# EAGLE design MultiRotorHub (EAGLE 7.4.0)
CNAME: MR Hub; CREVISION: 1.0; DESIGNER: Ye Wang
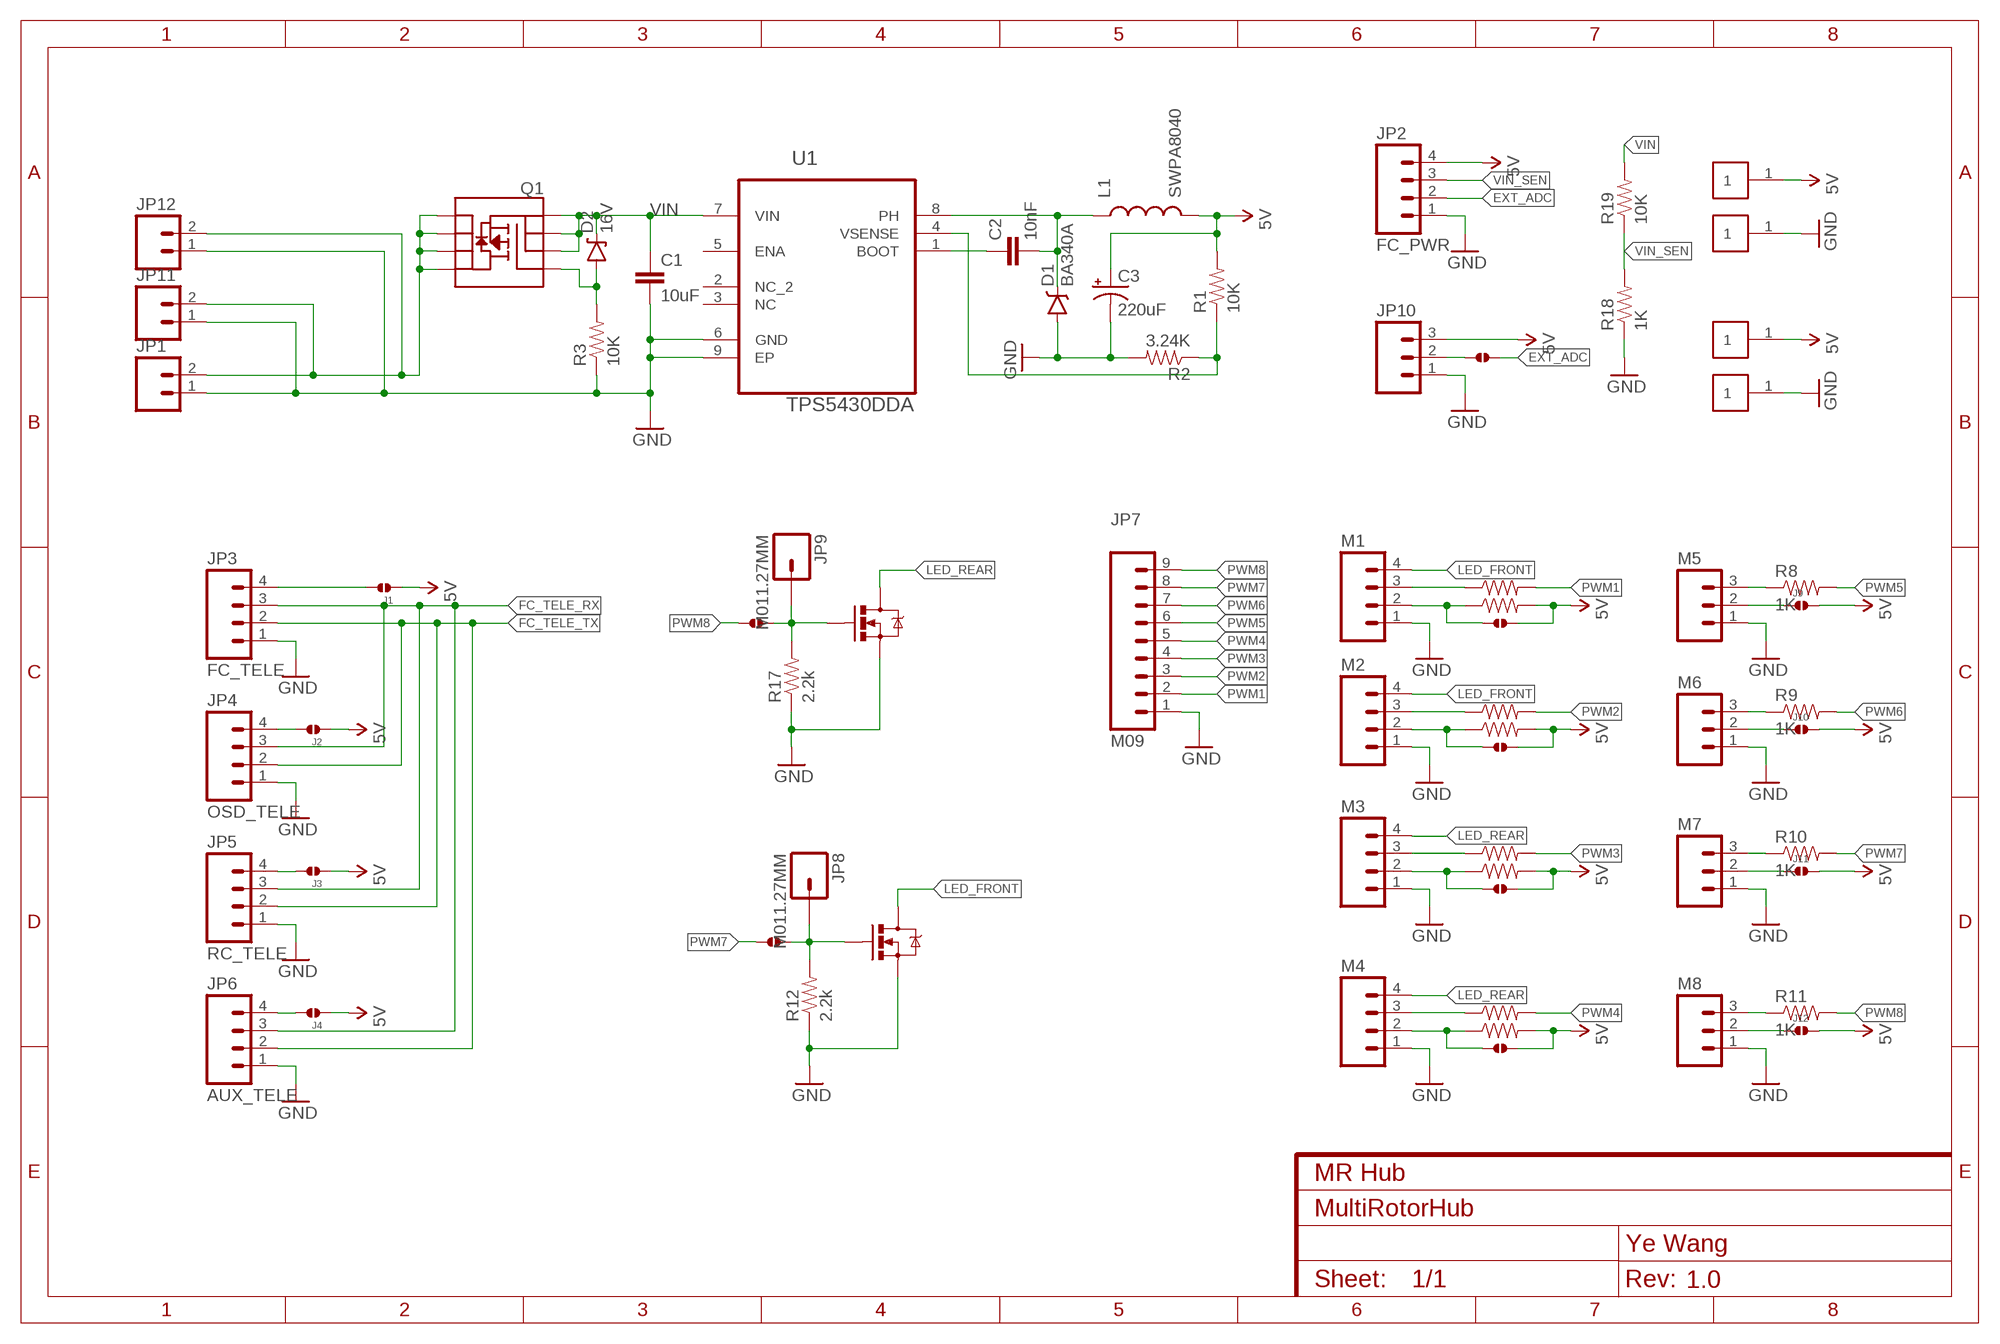
[diagram p0: schematic, sheet 1]

## Parts
C1  10uF  CAP1206  [1206]
C2  10nF  10NF/10000PF-50V-10%(0603)  [0603-CAP]
C3  220uF  CAP_POLD  [PANASONIC_D]
CON1  CON1P2.54MM  [SMD2.54MM]
CON2  CON1P2.54MM  [SMD2.54MM]
CON3  CON1P2.54MM  [SMD2.54MM]
CON4  CON1P2.54MM  [SMD2.54MM]
D1  BA340A  B340A  [SMA-DIODE]
D2  16V  DIODE-ZENER16V  [SOD-123]
J1  SOLDERJUMPER.2.MED  [2.MED]
J2  SOLDERJUMPER.2.MED  [2.MED]
J3  SOLDERJUMPER.2.MED  [2.MED]
J4  SOLDERJUMPER.2.MED  [2.MED]
J5  SOLDERJUMPER.2.MED  [2.MED]
J6  SOLDERJUMPER.2.MED  [2.MED]
J7  SOLDERJUMPER.2.MED  [2.MED]
J8  SOLDERJUMPER.2.MED  [2.MED]
J9  SOLDERJUMPER.2.MED  [2.MED]
J10  SOLDERJUMPER.2.MED  [2.MED]
J11  SOLDERJUMPER.2.MED  [2.MED]
J12  SOLDERJUMPER.2.MED  [2.MED]
J13  SOLDERJUMPER.2.MED  [2.MED]
J14  SOLDERJUMPER.2.MED  [2.MED]
J15  SOLDERJUMPER.2.MED  [2.MED]
JP1  M02PTH  [1X02]
JP2  FC_PWR  M041.27MM  [1X04-1.27MM]
JP3  FC_TELE  M041.27MM  [1X04-1.27MM]
JP4  OSD_TELE  M041.27MM  [1X04-1.27MM]
JP5  RC_TELE  M041.27MM  [1X04-1.27MM]
JP6  AUX_TELE  M041.27MM  [1X04-1.27MM]
JP7  M09  [1X09]
JP8  M011.27MM  [1X01-1.27MM]
JP9  M011.27MM  [1X01-1.27MM]
JP10  M03M03-1.27MM  [1X03-1.27MM]
JP11  M02PTH  [1X02]
JP12  M02PTH  [1X02]
L1  SWPA8040  [INC8040]
M1  M04PTH  [1X04]
M2  M04PTH  [1X04]
M3  M04PTH  [1X04]
M4  M04PTH  [1X04]
M5  M03PTH  [1X03]
M6  M03PTH  [1X03]
M7  M03PTH  [1X03]
M8  M03PTH  [1X03]
Q1  MOSFET-PCHANNEL-SOIC8SOIC8  [SO08]
Q2  MOSFET-NCHANNELBSS123LT1G  [SOT23-3]
Q3  MOSFET-NCHANNELBSS123LT1G  [SOT23-3]
R1  10K  10KOHM-1/10W-1%(0603)0603  [0603-RES]
R2  3.24K  RESISTOR0603-RES  [0603-RES]
R3  10K  10KOHM-1/10W-1%(0603)0603  [0603-RES]
R4  1K  RESISTOR0603-RES  [0603-RES]
R5  1K  RESISTOR0603-RES  [0603-RES]
R6  1K  RESISTOR0603-RES  [0603-RES]
R7  1K  RESISTOR0603-RES  [0603-RES]
R8  1K  RESISTOR0603-RES  [0603-RES]
R9  1K  RESISTOR0603-RES  [0603-RES]
R10  1K  RESISTOR0603-RES  [0603-RES]
R11  1K  RESISTOR0603-RES  [0603-RES]
R12  2.2k  2.2KOHM-1/10W-1%(0603)  [0603-RES]
R13  10  RESISTOR2512  [R2512]
R14  10  RESISTOR2512  [R2512]
R15  10  RESISTOR2512  [R2512]
R16  10  RESISTOR2512  [R2512]
R17  2.2k  2.2KOHM-1/10W-1%(0603)  [0603-RES]
R18  1K  1KOHM-1/10W-1%(0603)  [0603-RES]
R19  10K  10KOHM-1/10W-1%(0603)0603  [0603-RES]
U1  TPS5430DDA  [SOIC127P600X170-9N]

## Nets
5V: C3.+ CON1.1 CON3.1 J1.1 J2.1 J3.1 J4.1 J5.2 J6.2 J7.2 J8.2 J9.2 J10.2 J11.2 J12.2 JP2.4 JP10.3 L1.2 R1.2 R13.2 R14.2 R15.2 R16.2
EXT_ADC: J15.2 JP2.2
FC_TELE_RX: JP3.3 JP4.3 JP5.3 JP6.3
FC_TELE_TX: JP3.2 JP4.2 JP5.2 JP6.2
GND: C1.2 C3.- CON2.1 CON4.1 D1.A JP1.1 JP2.1 JP3.1 JP4.1 JP5.1 JP6.1 JP7.1 JP10.1 JP11.1 JP12.1 M1.1 M2.1 M3.1 M4.1 M5.1 M6.1 M7.1 M8.1 Q2.2(S) Q3.2(S) R2.2 R3.1 R12.1 R17.1 R18.1 U1.6(GND) U1.9(EP)
LED_FRONT: M1.4 M2.4 Q2.3(D)
LED_REAR: M3.4 M4.4 Q3.3(D)
N$1: C2.1 U1.1(BOOT)
N$2: J1.2 JP3.4
N$4: R1.1 R2.1 U1.4(VSENSE)
N$5: D2.A Q1.4(G) R3.2
N$6: J3.2 JP5.4
N$8: J4.2 JP6.4
N$9: J2.2 JP4.4
N$10: J5.1 M1.2 R13.1
N$11: M1.3 R4.1
N$12: J6.1 M2.2 R14.1
N$13: M2.3 R5.1
N$14: J7.1 M3.2 R15.1
N$15: M3.3 R6.1
N$16: J8.1 M4.2 R16.1
N$17: M4.3 R7.1
N$18: J9.1 M5.2
N$19: M5.3 R8.1
N$20: J10.1 M6.2
N$21: M6.3 R9.1
N$22: J11.1 M7.2
N$23: M7.3 R10.1
N$24: J12.1 M8.2
N$25: M8.3 R11.1
N$26: J13.2 JP8.1 Q2.1(G) R12.2
N$27: J14.2 JP9.1 Q3.1(G) R17.2
N$28: J15.1 JP10.2
PWM1: JP7.2 R4.2
PWM2: JP7.3 R5.2
PWM3: JP7.4 R6.2
PWM4: JP7.5 R7.2
PWM5: JP7.6 R8.2
PWM6: JP7.7 R9.2
PWM7: J13.1 JP7.8 R10.2
PWM8: J14.1 JP7.9 R11.2
V_BATT: JP1.2 JP11.2 JP12.2 Q1.5(D) Q1.6(D) Q1.7(D) Q1.8(D)
V_OUT: C2.2 D1.C L1.1 U1.8(PH)
VIN: C1.1 D2.C Q1.1(S) Q1.2(S) Q1.3(S) R19.2 U1.7(VIN)
VIN_SEN: JP2.3 R18.2 R19.1
Unconnected: U1.2(NC_2) U1.3(NC) U1.5(ENA)

## Library data of the parts
C1 = SparkFun-Capacitors:CAP: Capacitor Standard 0603 ceramic capacitor, and 0.1" leaded capacitor.
C2 = SparkFun-Capacitors:10NF/10000PF-50V-10%(0603): CAP-00867; PROD_ID: CAP-00867
C3 = SparkFun-Capacitors:CAP_POL: Capacitor Polarized These are standard SMD and PTH capacitors. Normally 10uF, 47uF, and 100uF in electrolytic and tantalum varieties. Always verify the external diameter of the through hole cap, it varies with capacity, voltage, and manufacturer. The EIA devices should be standard.
CON1-CON4 = szjlc:CON1P
D1 = SparkFun-DiscreteSemi:B340A: Schottky Diode 3A-40V; PROD_ID: DIO-09886
D2 = SparkFun-DiscreteSemi:DIODE-ZENER: Zener Diode Production Part - 8199 3.4V Zener Voltage; PROD_ID: DIO-12440
J1-J15 = solderjumper:SOLDERJUMPER.2
JP1 JP11 JP12 = SparkFun-Connectors:M02: Standard 2-pin 0.1" header. Use with - straight break away headers ( PRT-00116) - right angle break away headers (PRT-00553) - swiss pins (PRT-00743) - machine pins (PRT-00117) - female headers (PRT-00115) Molex polarized connector foot print use with: PRT-08233 with associated crimp pins and housings. 2.54_SCREWTERM for use with PRT-10571. 3.5mm Screw Terminal footprints for PRT-08084 5mm Screw Terminal footprints for use with PRT-08432
JP2-JP6 M1-M4 = SparkFun-Connectors:M04: Header 4 Standard 4-pin 0.1" header. Use with straight break away headers (SKU : PRT-00116), right angle break away headers (PRT-00553), swiss pins (PRT-00743), machine pins (PRT-00117), and female headers (PRT-00115). Molex polarized connector foot print use with SKU : PRT-08231 with associated crimp pins and housings. 1MM SMD Version SKU: PRT-10208
JP7 = SparkFun-Connectors:M09: Header 9 Standard 9-pin 0.1" header. Use with straight break away headers (SKU : PRT-00116), right angle break away headers (PRT-00553), swiss pins (PRT-00743), machine pins (PRT-00117), and female headers (PRT-00115).
JP8 JP9 = SparkFun-Connectors:M01: Header 1 Standard 1-pin 0.1" header. Use with straight break away headers (SKU : PRT-00116), right angle break away headers (PRT-00553), swiss pins (PRT-00743), machine pins (PRT-00117), and female headers (PRT-00115).
JP10 M5-M8 = SparkFun-Connectors:M03: Header 3 Standard 3-pin 0.1" header. Use with straight break away headers (SKU : PRT-00116), right angle break away headers (PRT-00553), swiss pins (PRT-00743), machine pins (PRT-00117), and female headers (PRT-00115). Molex polarized connector foot print use with SKU : PRT-08232 with associated crimp pins and housings.
L1 = inductor:SWPA
Q1 = SparkFun-DiscreteSemi:MOSFET-PCHANNEL-SOIC8: Generic 8-pin PMOSFET
Q2 Q3 = SparkFun-DiscreteSemi:MOSFET-NCHANNEL: Common NMOSFET Parts MFG P/N Store ID Prod ID FDD8780 TRANS-09984 SI7820DN TRANS-11055 FDS6630A IC-08089 2N7002PW TRANS-11151 FQP30N06L COM-10213 TRANS-10060 BSS123LT1G TRANS-08345 BSS138 TRANS-00830 BS170 2N7000; PROD_ID: TRANS-08345
R1 R3 R19 = SparkFun-Resistors:10KOHM-1/10W-1%(0603): RES-00824; PROD_ID: RES-00824
R2 R4-R11 R13-R16 = SparkFun-Resistors:RESISTOR: Resistor Basic schematic elements and footprints for 0603, 1206, and PTH resistors.
R12 R17 = SparkFun-Resistors:2.2KOHM-1/10W-1%(0603): RES-08272; PROD_ID: RES-08272
R18 = SparkFun-Resistors:1KOHM-1/10W-1%(0603): RES-07856; PROD_ID: RES-07856
U1 = ti_misc:TPS5430DDA: 3-A, WIDE INPUT RANGE, STEP-DOWN SWIFT CONVERTER; MPN: TPS5430DDA; OC_FARNELL: -; OC_NEWARK: 75K1619; PACKAGE: SOIC-8; SUPPLIER: Texas Instruments

## Board
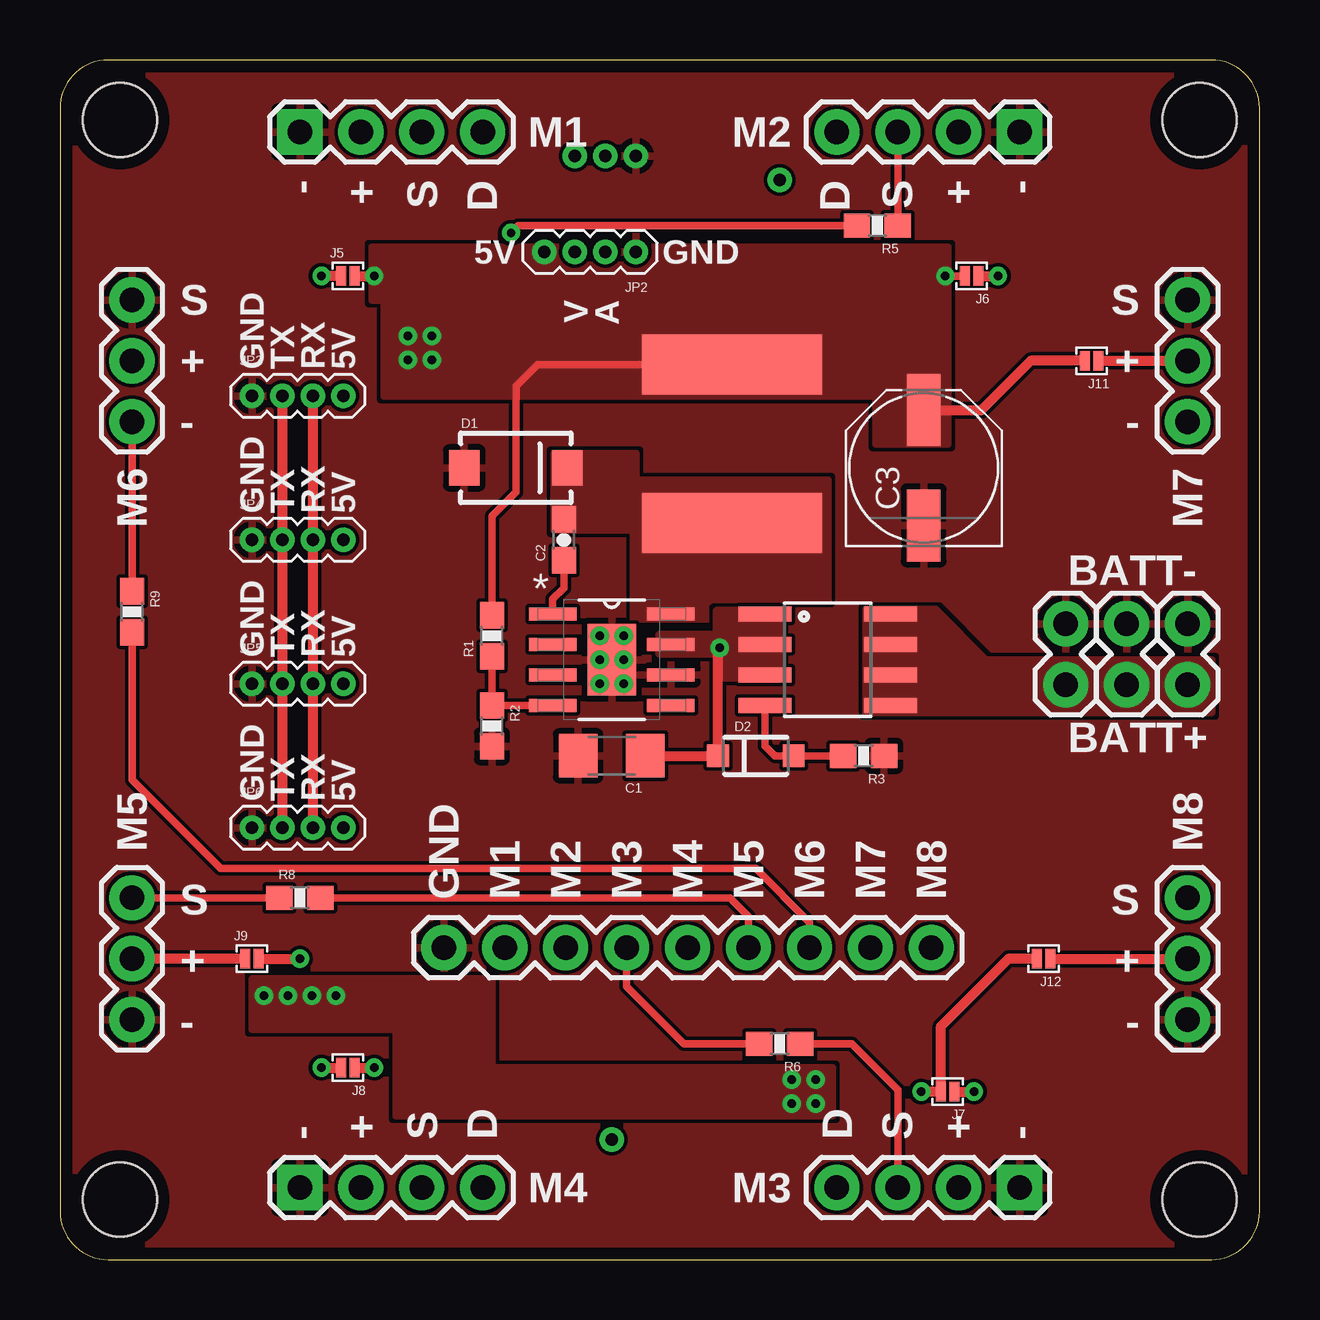
[diagram p1: board, top side]
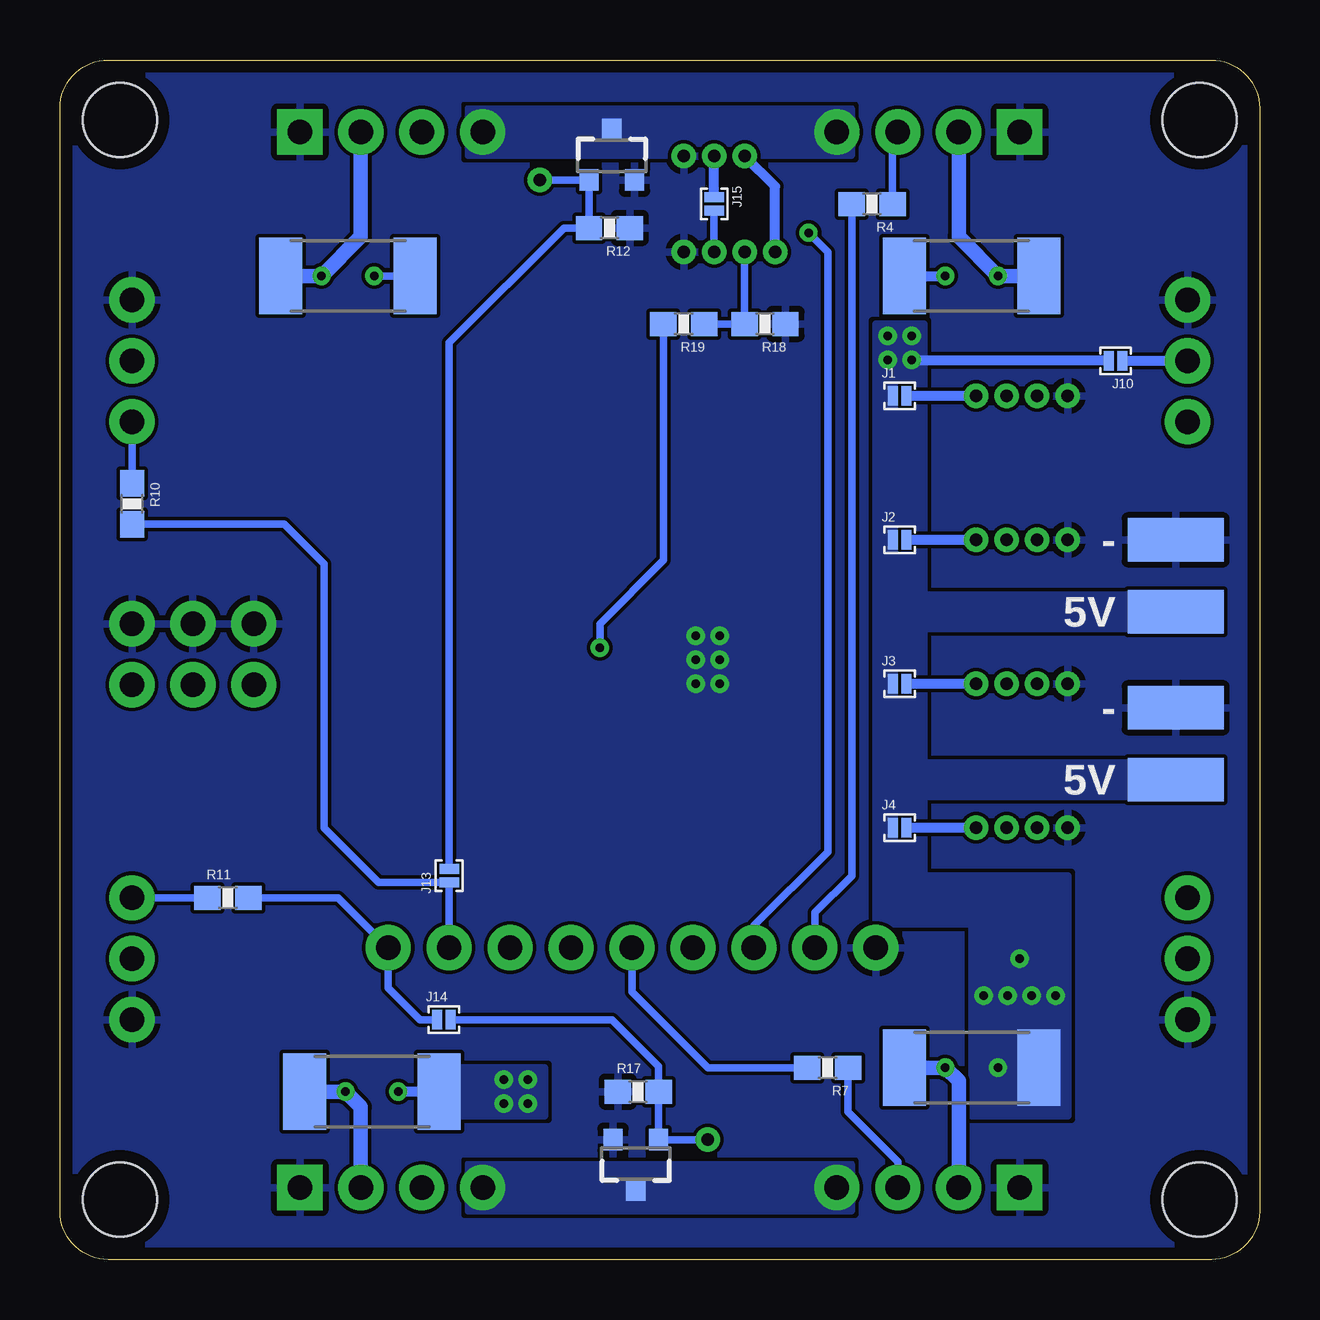
[diagram p2: board, bottom side, seen from below]

Size 50 x 50 mm. Coordinates in mm from the lower left corner, seen from the top.
Outline: 2,0 48,0 arc90 50,2 50,48 arc90 48,50 2,50 arc90 0,48 0,2 arc90 2,0
Copper layers (1*16): Top 0.035mm / dielectric 1.5mm / Bottom 0.035mm
Design rules "default *": minimum track width 8mil, minimum drill 0.3mm, track to track 6mil, track to pad 6mil, pad to pad 6mil, via to via 6mil, smd to smd 6mil, copper to edge 20mil, drill to drill 8mil, minimum pad ring 10mil, minimum via ring 8mil, stop-mask expansion 4mil, vias tented up to drill 0.355mm, thermal gap 10mil
Holes 3.1 mm at 2.5,2.5 47.5,2.5 47.5,47.5 2.5,47.5

### Footprints (pad centres in the part's own frame; a part is rotated, then mirrored left to right if it is on the bottom)
1206 = smd 1.6 x 1.8: 1 -1.4,0; 2 1.4,0
0603-CAP = smd 1.1 x 1: 1 -0.85,0; 2 0.85,0
PANASONIC_D = smd 3 x 1.4: + 2.4,0; - -2.4,0
SMD2.54MM = smd 1.8 x 4: 1 0,0
SMA-DIODE = smd 1.27 x 1.47: A -2.15,0; C 2.15,0
SOD-123 = smd 0.9 x 0.95: A 1.575,0; C -1.575,0
2.MED = smd 0.406 x 0.813: 1 -0.279,0; 2 0.279,0
1X02 = drill 1.016 pad 1.88: 1 0,0; 2 2.54,0
1X04-1.27MM = drill 0.508 pad 1: 1 0,0; 2 1.27,0; 3 2.54,0; 4 3.81,0
1X09 = drill 1.016 pad 1.88: 1 0,0; 2 2.54,0; 3 5.08,0; 4 7.62,0; 5 10.16,0; 6 12.7,0; 7 15.24,0; 8 17.78,0; 9 20.32,0
1X01-1.27MM = drill 0.508 pad 1: 1 0,0
1X03-1.27MM = drill 0.508 pad 1: 1 0,0; 2 1.27,0; 3 2.54,0
INC8040 = smd 2.5 x 7.5: 1 -3.3,0; 2 3.3,0
1X04 = drill 1.016 pad 1.88 square: 1 0,0 | drill 1.016 pad 1.88: 2 2.54,0; 3 5.08,0; 4 7.62,0
1X03 = drill 1.016 pad 1.88: 1 0,0; 2 2.54,0; 3 5.08,0
SO08 = smd 0.61 x 2.21: 1 -1.905,-2.616; 2 -0.635,-2.616; 3 0.635,-2.616; 4 1.905,-2.616; 5 1.905,2.616; 6 0.635,2.616; 7 -0.635,2.616; 8 -1.905,2.616
SOT23-3 = smd 0.8 x 0.9: 1 -0.95,-1; 2 0.95,-1; 3 0,1.1
0603-RES = smd 1.1 x 1: 1 -0.85,0; 2 0.85,0
R2512 = smd 1.8 x 3.2: 1 -2.8,0; 2 2.8,0
SOIC127P600X170-9N = smd 1.981 x 0.559: 1 -2.464,1.905; 2 -2.464,0.635; 3 -2.464,-0.635; 4 -2.464,-1.905; 5 2.464,-1.905; 6 2.464,-0.635; 7 2.464,0.635; 8 2.464,1.905 | smd 2.007 x 2.997: 9 0,0

### Placement (x,y rotation side)
C1  23,21 180 top
C2  21,30 90 top
C3  36,33 90 top
CON1  3.5,27 90 bottom
CON2  3.5,30 270 bottom
CON3  3.5,20 270 bottom
CON4  3.5,23 270 bottom
D1  19,33 0 top
D2  29,21 0 top
J1  15,36 0 bottom
J2  15,30 0 bottom
J3  15,24 0 bottom
J4  15,18 0 bottom
J5  12,41 0 top
J6  38,41 180 top
J7  37,7 180 top
J8  12,8 180 top
J9  8,12.54 0 top
J10  6,37.46 180 bottom
J11  43,37.46 180 top
J12  41,12.54 180 top
J13  33.78,16 90 bottom
J14  34,10 0 bottom
J15  22.73,44 270 bottom
JP1  47,26.5 270 top
JP2  24,42 180 top
JP3  8,36 0 top
JP4  8,30 0 top
JP5  8,24 0 top
JP6  8,18 0 top
JP7  16,13 0 top
JP8  30,45 0 top
JP9  23,5 0 top
JP10  24,46 180 top
JP11  41.92,26.5 270 top
JP12  44.46,26.5 270 top
L1  28,34 90 top
M1  10,47 0 top
M2  40,47 180 top
M3  40,3 180 top
M4  10,3 0 top
M5  3,10 90 top
M6  3,40 270 top
M7  47,40 270 top
M8  47,10 90 top
Q1  32,25 270 top
Q2  27,46 0 bottom
Q3  26,4 180 bottom
R1  18,26 90 top
R2  18,22.25 270 top
R3  33.5,21 180 top
R4  16.15,44 180 bottom
R5  34.07,43.1 180 top
R6  30,9 180 top
R7  18,8 180 bottom
R8  10,15.08 0 top
R9  3,27 270 top
R10  47,31.5 270 bottom
R11  43,15.08 0 bottom
R12  27.1,43 180 bottom
R13  12,41 180 bottom
R14  38,41 0 bottom
R15  37,7 0 bottom
R16  12,8 0 bottom
R17  25.9,7 0 bottom
R18  20.61,39 180 bottom
R19  24,39 180 bottom
U1  23,25 0 top

### Tracks (layer width: path | path; a pad name or v marks a point on that pad's centre or on a via)
5V  (via drill 0.35)
  Top 0.305: R1.2 18,31 19,32 19,36.4 19.9,37.3 L1.2 | v36.9,41 J6.2
  Top 0.406: v10.9,8 J8.2 | v35.9,7 J7.2 36.72,9.72 39.54,12.54 J12.2 | J9.2 v10,12.54 | C3.+ 38.4,35.4 40.46,37.46 J11.2 | J5.2 v13.1,41
  Bottom 0.305: R14.2 v36.9,41
  Bottom 0.406: R15.2 v35.9,7 | R13.2 v13.1,41 | J10.2 14.46,37.46 v14.5,37.5 | JP2.4 20.19,44.73 JP10.3
  other vias: 30.5,6.5 15.5,37.5 15.5,38.5 14.5,38.5 8.5,11 9.5,11 10.5,11 11.5,11 31.5,7.5 31.5,6.5 30.5,7.5
  pour Top (no thermals): 13.5,36 34,36 34,34 37,34 37,42.2 13,42.2 13,40 13.5,40
  pour Bottom (no thermals): 14,39 14,27.7 5,27.7 5,26.3 14,26.3 14,20.7 5,20.7 5,19.3 14,19.3 14,16 8,16 8,6 12,6 12,14 16,14 16,39
  pour Top: 8,9.6 14,9.6 14,6 32.2,6 32.2,8 18,8 18,11.7 8,11.7
  pour Bottom (no thermals): 29.8,6 34,6 34,8 29.8,8
EXT_ADC
  Bottom 0.305: J15.2 JP2.2
FC_TELE_RX
  Top 0.406: JP3.3 JP4.3 JP5.3 JP6.3
FC_TELE_TX
  Top 0.406: JP3.2 JP4.2 JP5.2 JP6.2
GND  (via drill 0.36)
  other vias: 22.5,26 23.5,26 23.5,25 22.5,25 22.5,24 23.5,24
  pour Top (rank 3): 0,50 50,50 50,0 0,0
  pour Bottom (rank 3): 0,0 50,0 50,50 0,50
LED_FRONT
  pour Bottom (no thermals): 17,46 33,46 33,48 17,48
LED_REAR
  pour Bottom (no thermals): 17,2 33,2 33,4 17,4
N$1
  Top 0.305: C2.1 21,28 20.54,27.54 U1.1
N$2
  Bottom 0.406: JP3.4 J1.2
N$4
  Top 0.305: U1.4 R2.1 R1.1
N$5
  Top 0.305: Q1.4 29.38,21.42 29.8,21 D2.A R3.2
N$6
  Bottom 0.406: JP5.4 J3.2
N$8
  Bottom 0.406: JP6.4 J4.2
N$9
  Bottom 0.406: JP4.4 J2.2
N$10  (via drill 0.35)
  Top 0.406: J5.1 v10.9,41
  Bottom 0.61: M1.2 12.54,42.64 v10.9,41 R13.1
N$11
  Bottom 0.305: R4.1 15.3,46.78 M1.3
N$12  (via drill 0.35)
  Top 0.406: J6.1 v39.1,41
  Bottom 0.61: M2.2 37.46,42.64 v39.1,41 R14.1
N$13
  Top 0.305: M2.3 R5.1
N$14  (via drill 0.35)
  Top 0.406: J7.1 v38.1,7
  Bottom 0.61: M3.2 37.46,6.36 v38.1,7 R15.1
N$15
  Top 0.305: M3.3 34.92,7.08 33,9 R6.1
N$16  (via drill 0.35)
  Top 0.406: J8.1 v13.1,8
  Bottom 0.61: M4.2 12.54,7.44 v13.1,8 R16.1
N$17
  Bottom 0.305: M4.3 15.08,4.08 17.15,6.15 R7.1
N$18
  Top 0.406: J9.1 M5.2
N$19
  Top 0.305: M5.3 R8.1
N$20
  Bottom 0.406: J10.1 M6.2
N$21
  Top 0.305: M6.3 R9.1
N$22
  Top 0.406: J11.1 M7.2
N$23
  Bottom 0.305: R10.1 M7.3
N$24
  Top 0.406: J12.1 M8.2
N$25
  Bottom 0.305: M8.3 R11.1
N$26
  Bottom 0.305: JP8.1 Q2.1 R12.2 29,43 33.78,38.22 J13.2
N$27
  Bottom 0.305: J14.2 27,10 25.05,8.05 R17.2 Q3.1 JP9.1
N$28
  Bottom 0.406: J15.1 JP10.2
PWM1
  Bottom 0.305: JP7.2 18.54,14.46 17,16 R4.2
PWM2  (via drill 0.35)
  Top 0.305: R5.2 19.1,43.1 v18.8,42.8
  Bottom 0.305: v18.8,42.8 18,42 18,17 21.08,13.92 JP7.3
PWM3
  Top 0.305: JP7.4 23.62,11.38 26,9 R6.2
PWM4
  Bottom 0.305: JP7.5 26.16,11.16 23,8 R7.2
PWM5
  Top 0.305: JP7.6 28.7,14.3 27.92,15.08 R8.2
PWM6
  Top 0.305: JP7.7 31.24,14.06 29,16.3 6.7,16.3 3,20 R9.2
PWM7
  Bottom 0.305: R10.2 40.65,30.65 39,29 39,18 36.72,15.72 J13.1 JP7.8
PWM8
  Bottom 0.305: J14.1 35,10 36.32,11.32 JP7.9 38.4,15.08 R11.2
V_BATT
  pour Top (no thermals): 33.6,22.8 48,22.8 48,25 38.6,25 36.5,27.1 33.6,27.1
V_OUT
  pour Top (rank 2, no thermals): 20.6,30.4 23.9,30.4 23.9,26.7 27,26.7 27,27.5 32,27.5 32,32.5 24,32.5 24,33.6 20.6,33.6
VIN  (via drill 0.35)
  Top 0.406: C1.1 D2.C 27.43,25.43 v27.5,25.5
  Bottom 0.305: v27.5,25.5 27.5,26.5 24.85,29.15 R19.2
  pour Top (no thermals): 25,25.3 27.4,25.3 27.4,24.3 30,24.3 30,27 27.4,27 27.4,26 25,26
VIN_SEN
  Bottom 0.305: R19.1 R18.2 JP2.3

### Text on the board
tPlace: - | + | S | D | D | S | + | - | 5V | GND | S | V | A | S | + | GND | TX | RX | 5V | + | - | - | GND | TX | RX | 5V | BATT- | GND | TX | RX | 5V | BATT+ | GND | TX | RX | 5V | S | GND | M1 | M2 | M3 | M4 | M5 | M6 | M7 | M8 | S | + | + | - | - | - | + | S | D | D | S | + | -
bPlace: - | 5V | - | 5V